# Altium schematic sheet BlockDiagram.SchDoc: Block Diagram
size A3; ProjectName: DCAC converter
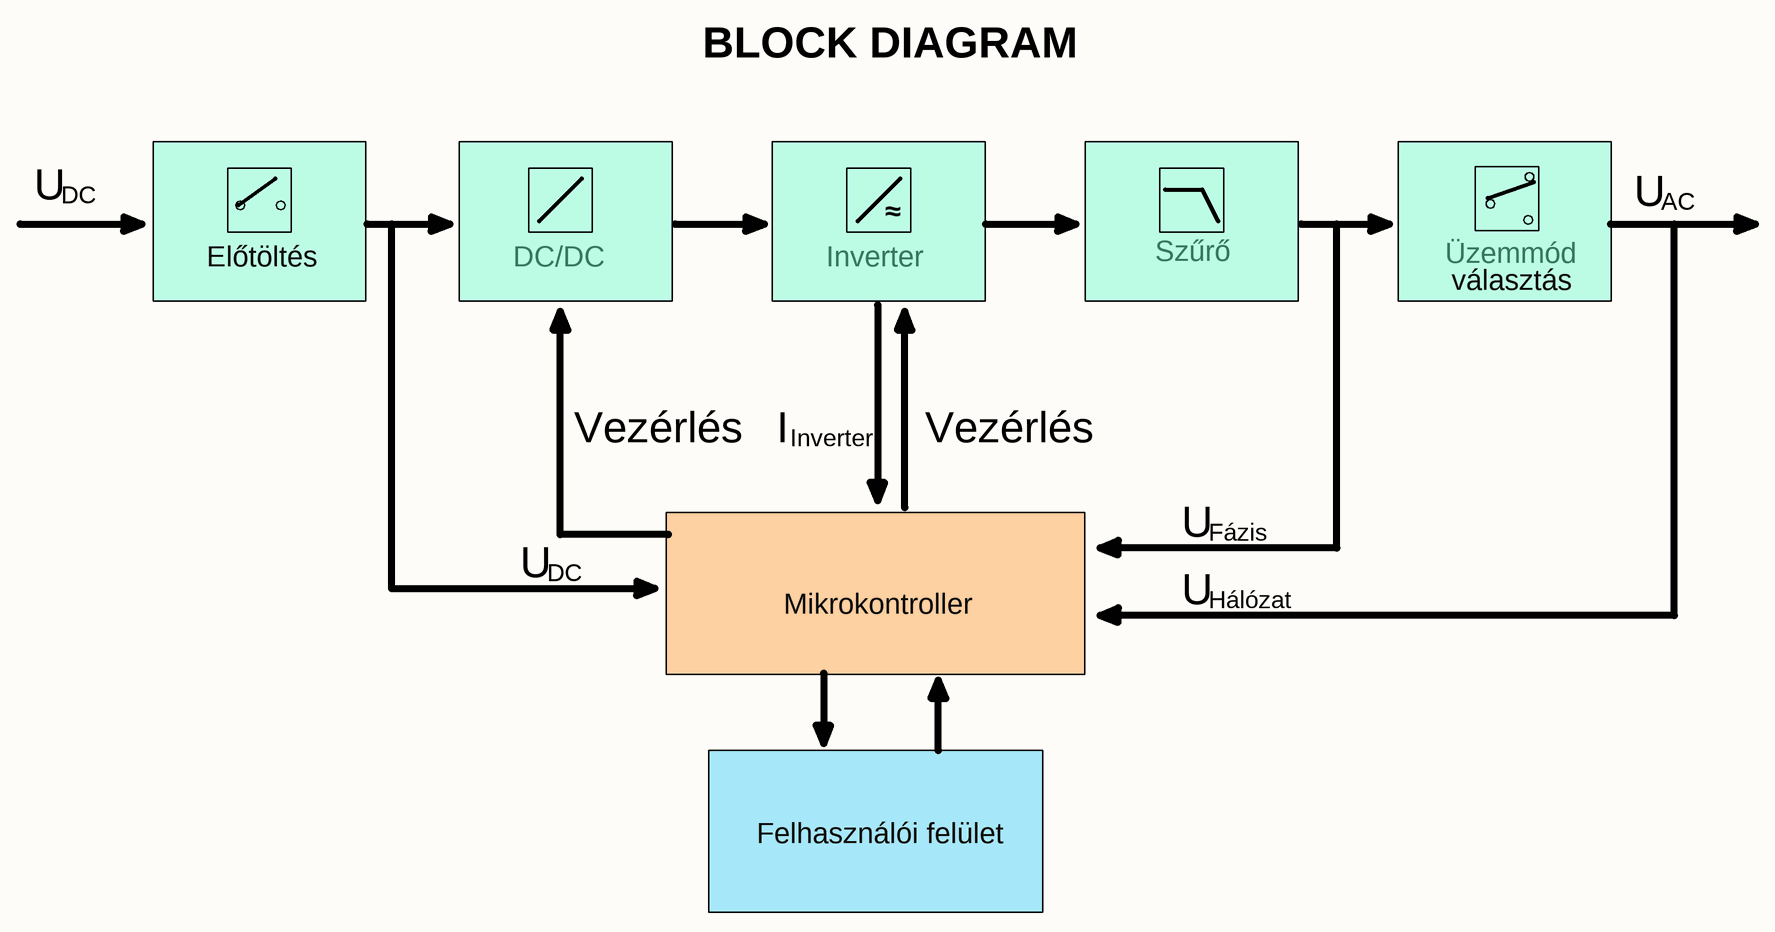
[diagram p0: BlockDiagram.SchDoc]

## Notes on the sheet
- BLOCK DIAGRAM
- U
- DC
- ~
- AC
- Előtöltés
- DC/DC
- Inverter
- Szűrő
- Üzemmód
- választás
- Vezérlés
- I
- Fázis
- Mikrokontroller
- Hálózat
- Felhasználói felület